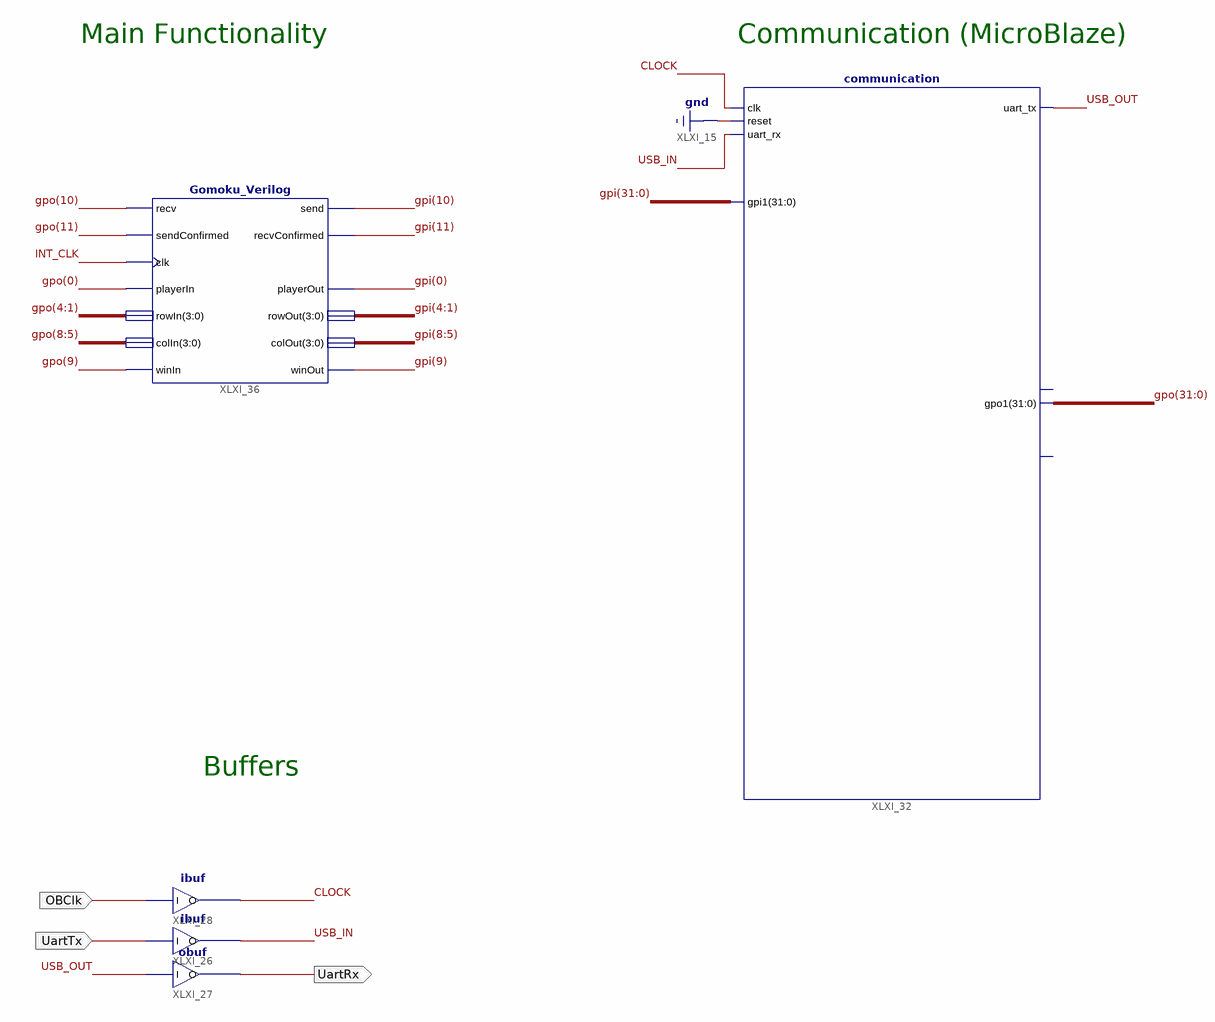
[diagram p0: schematic sheet 1]
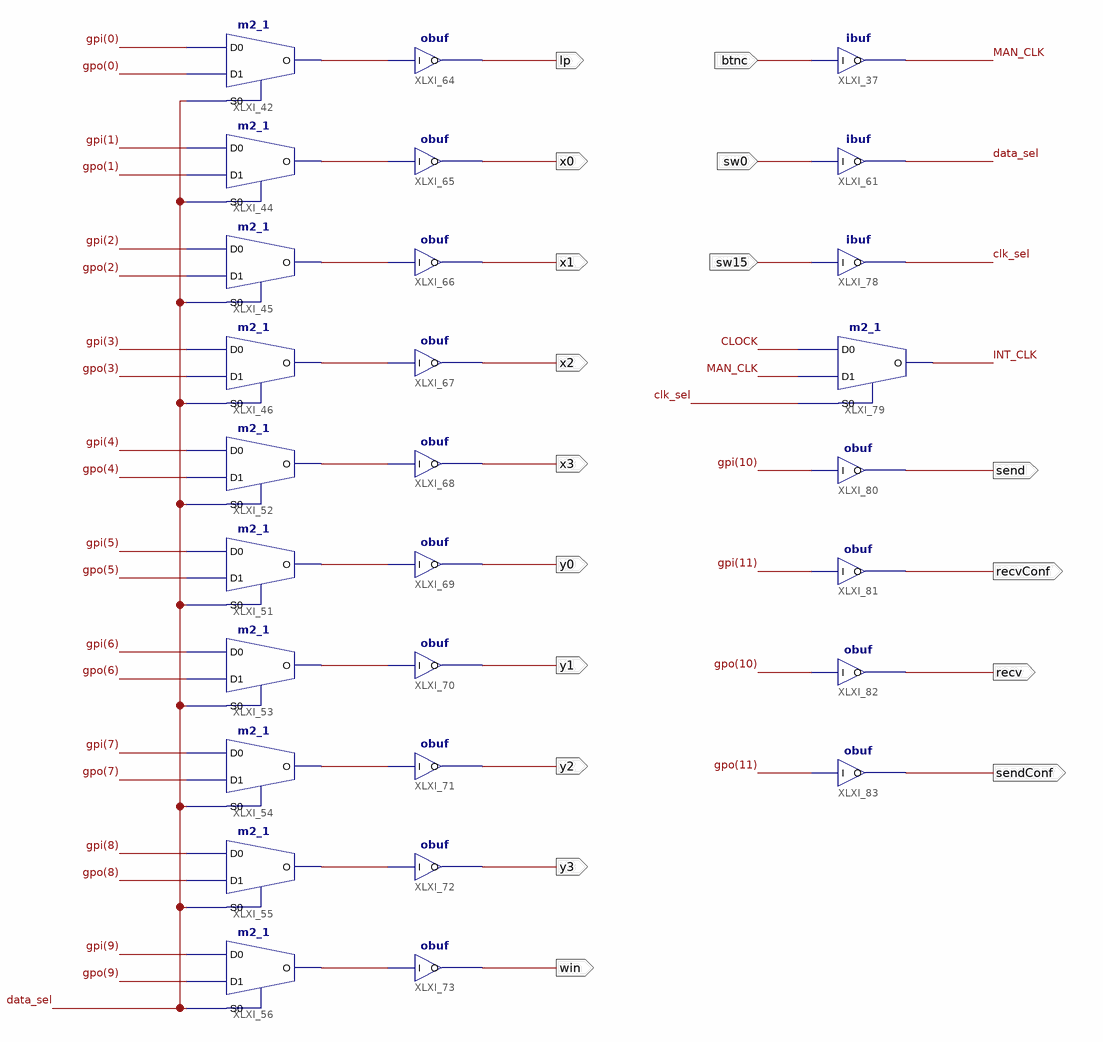
[diagram p1: schematic sheet 2]
// Xilinx ISE schematic simple.sch (artix7) as structural Verilog: 33 symbols, 20 ports
module simple (
  input  OBClk,
  input  UartTx,
  input  btnc,
  input  sw0,
  input  sw15,
  output UartRx,
  output lp,
  output x0,
  output x1,
  output x2,
  output x3,
  output y0,
  output y1,
  output y2,
  output y3,
  output win,
  output send,
  output recvConf,
  output recv,
  output sendConf
);

  wire clk_sel, CLOCK, data_sel, INT_CLK, MAN_CLK, USB_IN, USB_OUT, XLXN_94, XLXN_95, XLXN_96, XLXN_97,
       XLXN_98, XLXN_99, XLXN_100, XLXN_101, XLXN_102, XLXN_103;
  wire [31:0] gpi, gpo;

  ibuf XLXI_26 (.I(UartTx), .O(USB_IN));
  obuf XLXI_27 (.I(USB_OUT), .O(UartRx));
  ibuf XLXI_28 (.I(OBClk), .O(CLOCK));
  communication XLXI_32 (
    .clk(CLOCK), .reset(1'b0), .uart_tx(USB_OUT), .uart_rx(USB_IN), .gpi1(gpi), .gpo1(gpo));  // open: uart_interrupt, intc_irq
  Gomoku_Verilog XLXI_36 (
    .playerIn(gpo[0]), .rowIn(gpo[4:1]), .colIn(gpo[8:5]), .winIn(gpo[9]), .playerOut(gpi[0]),
    .rowOut(gpi[4:1]), .colOut(gpi[8:5]), .winOut(gpi[9]), .clk(INT_CLK), .sendConfirmed(gpo[11]),
    .recv(gpo[10]), .recvConfirmed(gpi[11]), .send(gpi[10]));
  m2_1 XLXI_42 (.D0(gpi[0]), .D1(gpo[0]), .S0(data_sel), .O(XLXN_94));
  m2_1 XLXI_44 (.D0(gpi[1]), .D1(gpo[1]), .S0(data_sel), .O(XLXN_95));
  m2_1 XLXI_45 (.D0(gpi[2]), .D1(gpo[2]), .S0(data_sel), .O(XLXN_96));
  m2_1 XLXI_46 (.D0(gpi[3]), .D1(gpo[3]), .S0(data_sel), .O(XLXN_97));
  m2_1 XLXI_55 (.D0(gpi[8]), .D1(gpo[8]), .S0(data_sel), .O(XLXN_102));
  m2_1 XLXI_56 (.D0(gpi[9]), .D1(gpo[9]), .S0(data_sel), .O(XLXN_103));
  m2_1 XLXI_52 (.D0(gpi[4]), .D1(gpo[4]), .S0(data_sel), .O(XLXN_98));
  m2_1 XLXI_51 (.D0(gpi[5]), .D1(gpo[5]), .S0(data_sel), .O(XLXN_99));
  m2_1 XLXI_53 (.D0(gpi[6]), .D1(gpo[6]), .S0(data_sel), .O(XLXN_100));
  m2_1 XLXI_54 (.D0(gpi[7]), .D1(gpo[7]), .S0(data_sel), .O(XLXN_101));
  obuf XLXI_64 (.I(XLXN_94), .O(lp));
  obuf XLXI_65 (.I(XLXN_95), .O(x0));
  obuf XLXI_66 (.I(XLXN_96), .O(x1));
  obuf XLXI_67 (.I(XLXN_97), .O(x2));
  obuf XLXI_68 (.I(XLXN_98), .O(x3));
  obuf XLXI_69 (.I(XLXN_99), .O(y0));
  obuf XLXI_70 (.I(XLXN_100), .O(y1));
  obuf XLXI_71 (.I(XLXN_101), .O(y2));
  obuf XLXI_72 (.I(XLXN_102), .O(y3));
  obuf XLXI_73 (.I(XLXN_103), .O(win));
  ibuf XLXI_37 (.I(btnc), .O(MAN_CLK));
  ibuf XLXI_61 (.I(sw0), .O(data_sel));
  ibuf XLXI_78 (.I(sw15), .O(clk_sel));
  m2_1 XLXI_79 (.D0(CLOCK), .D1(MAN_CLK), .S0(clk_sel), .O(INT_CLK));
  obuf XLXI_80 (.I(gpi[10]), .O(send));
  obuf XLXI_81 (.I(gpi[11]), .O(recvConf));
  obuf XLXI_82 (.I(gpo[10]), .O(recv));
  obuf XLXI_83 (.I(gpo[11]), .O(sendConf));

  // Notes on the sheet:
  //   Main Functionality
  //   Communication (MicroBlaze)
  //   Buffers
endmodule
